# Altium schematic sheet Schematic.schdoc
size 174 x 89 mm
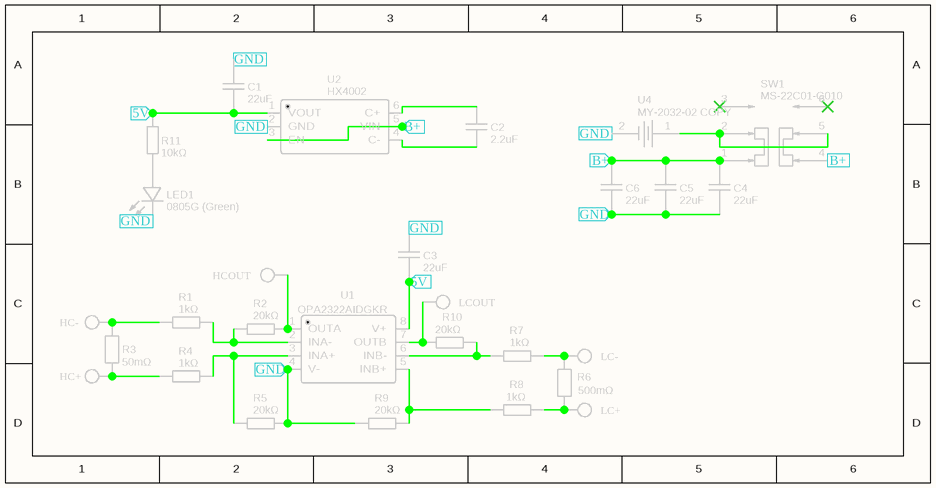
[diagram p0: Schematic.schdoc]

## Parts
C1  22uF  [C0603]
C2  2.2uF  [C0603]
C3  22uF  [C0603]
C4  22uF  [C0603]
C5  22uF  [C0603]
C6  22uF  [C0603]
HC+  Pad  [PAD]  (value not drawn)
HC-  Pad  [PAD]  (value not drawn)
HCOUT  Pad  [PAD]  (value not drawn)
LC+  Pad  [PAD]  (value not drawn)
LC-  Pad  [PAD]  (value not drawn)
LCOUT  Pad  [PAD]  (value not drawn)
LED1  0805G (Green)  [LED0805-R-RD]
R1  1kΩ  [R0402]
R2  20kΩ  [R0402]
R3  50mΩ  [R2512]
R4  1kΩ  [R0402]
R5  20kΩ  [R0402]
R6  500mΩ  [RES-SMD_L6.4-W3.2-R2512]
R7  1kΩ  [R0402]
R8  1kΩ  [R0402]
R9  20kΩ  [R0402]
R10  20kΩ  [R0402]
R11  10kΩ  [R0402]
SW1  MS-22C01-G010  [SW-SMD_6P-L7.2-W3.5-P2.50-LS6.0-TL]
U1  OPA2322AIDGKR  [VSSOP-8_L3.0-W3.0-P0.65-LS5.0-BL]
U2  HX4002  [SOT-23-6_L2.9-W1.6-P0.95-LS2.8-BR]
U4  MY-2032-02 COPY  [BATT-TH_MY-2032-02]

## Ports
5V (in), B+ (in), GND (in)

## Nets
5V: C1.1 C3.1 R11.2 U1.8(V+) U2.1(VOUT) ; port 5V
B+: C4.2 C5.2 C6.2 SW1.1 SW1.4 U2.3(EN) U2.5(VIN) ; port B+
GND: C1.2 C3.2 C4.1 C5.1 C6.1 LED1.2(K) R5.1 R9.2 U1.4(V-) U2.2(GND) U4.2 ; port GND
NetC2_1: C2.1 U2.4(C-)
NetC2_2: C2.2 U2.6(C+)
NetHC+_1: HC+.1 R3.1 R4.1
NetHC-_1: HC-.1 R1.1 R3.2
NetHCOUT_1: HCOUT.1 R2.2 U1.1(OUTA)
NetLC+_1: LC+.1 R6.1 R8.2
NetLC-_1: LC-.1 R6.2 R7.2
NetLCOUT_1: LCOUT.1 R10.1 U1.7(OUTB)
NetLED1_1: LED1.1(A) R11.1
NetR1_2: R1.2 R2.1 U1.2(INA-)
NetR4_2: R4.2 R5.2 U1.3(INA+)
NetR7_1: R7.1 R10.2 U1.6(INB-)
NetR8_1: R8.1 R9.1 U1.5(INB+)
NetSW1_2: SW1.2 SW1.5 U4.1

Not connected (* = marked no-connect by the designer): SW1 3* 6*

## Library data of the parts
C1 C3-C6 = 22uF: Manufacturer: SAMSUNG(三星); Manufacturer Part: CL10A226MQ8NRNC; nameAlias: Value; Supplier: LCSC; Supplier Part: C59461; JLCPCB Part Class: Basic Part; spicePre: C; spiceSymbolName: CL10A226MQ8NRNC
C2 = 2.2uF: Manufacturer Part: CL10A225KO8NNNC; Manufacturer: SAMSUNG(三星); nameAlias: Value; Supplier: LCSC; Supplier Part: C23630; JLCPCB Part Class: Basic Part; spicePre: C; spiceSymbolName: CL10A225KO8NNNC
LED1 = 0805G (Green): Manufacturer: KENTO; Manufacturer Part: KT-0805G; Supplier: LCSC; Supplier Part: C2297; JLCPCB Part Class: Basic Part; spicePre: L; spiceSymbolName: 0805G (Green)
R1 R4 R7 R8 = 1kΩ: Manufacturer: YAGEO(国巨); Manufacturer Part: RT0402BRD071KL; nameAlias: Value; Supplier: LCSC; Supplier Part: C852624; spicePre: R; spiceSymbolName: 0402WGF1001TCE
R2 R5 R9 R10 = 20kΩ: Manufacturer: YAGEO(国巨); Manufacturer Part: RT0402BRD0720KL; nameAlias: Value; Supplier: LCSC; Supplier Part: C705630; JLCPCB Part Class: Basic Part; spicePre: R; spiceSymbolName: 0402WGF2002TCE
R3 = 50mΩ: Manufacturer: JIERR(捷而瑞); Manufacturer Part: JER2512F2R050; nameAlias: Value; Contributor: lcsc; Supplier: LCSC; Supplier Part: C49164908; JLCPCB Part Class: Extended Part; spicePre: R; spiceSymbolName: JER2512F2R050
R6 = 500mΩ: Manufacturer: FOJAN(富捷); Manufacturer Part: FRM252WJR500TK; nameAlias: Value; Contributor: lcsc; Supplier: LCSC; Supplier Part: C7420030; JLCPCB Part Class: Extended Part; spicePre: R; spiceSymbolName: FRM252WJR500TK
R11 = 10kΩ: Manufacturer: UNI-ROYAL(厚声); Manufacturer Part: 0402WGF1002TCE; nameAlias: Value; Supplier: LCSC; Supplier Part: C25744; JLCPCB Part Class: Basic Part; spicePre: R; spiceSymbolName: 0402WGF1002TCE
SW1 = MS-22C01-G010: Manufacturer: G-Switch(品赞); Contributor: LCSC; Supplier: LCSC; Supplier Part: C2837066; Manufacturer Part: MS-22C01-G010; JLCPCB Part Class: Extended Part; spicePre: S; spiceSymbolName: MS-22C01-G010
U1 = OPA2322AIDGKR: Manufacturer: TI(德州仪器); Contributor: LCSC; Supplier: LCSC; Supplier Part: C2058180; Manufacturer Part: OPA2322AIDGKR; JLCPCB Part Class: Extended Part; spicePre: U; spiceSymbolName: OPA2322AIDGKR
U2 = HX4002: Manufacturer: HEXIN(禾芯微); Manufacturer Part: HX4002-MFC; Contributor: LCSC; Supplier: LCSC; Supplier Part: C172354; JLCPCB Part Class: Extended Part; spicePre: U; spiceSymbolName: HX4002
U4 = MY-2032-02 COPY: Manufacturer: MYOUNG(美阳); Contributor: lcsc; Supplier: LCSC; Supplier Part: C964822; Manufacturer Part: MY-2032-02; JLCPCB Part Class: Extended Part; spicePre: U; spiceSymbolName: MY-2032-02 COPY